# Altium project PCB_Project.PrjPcb
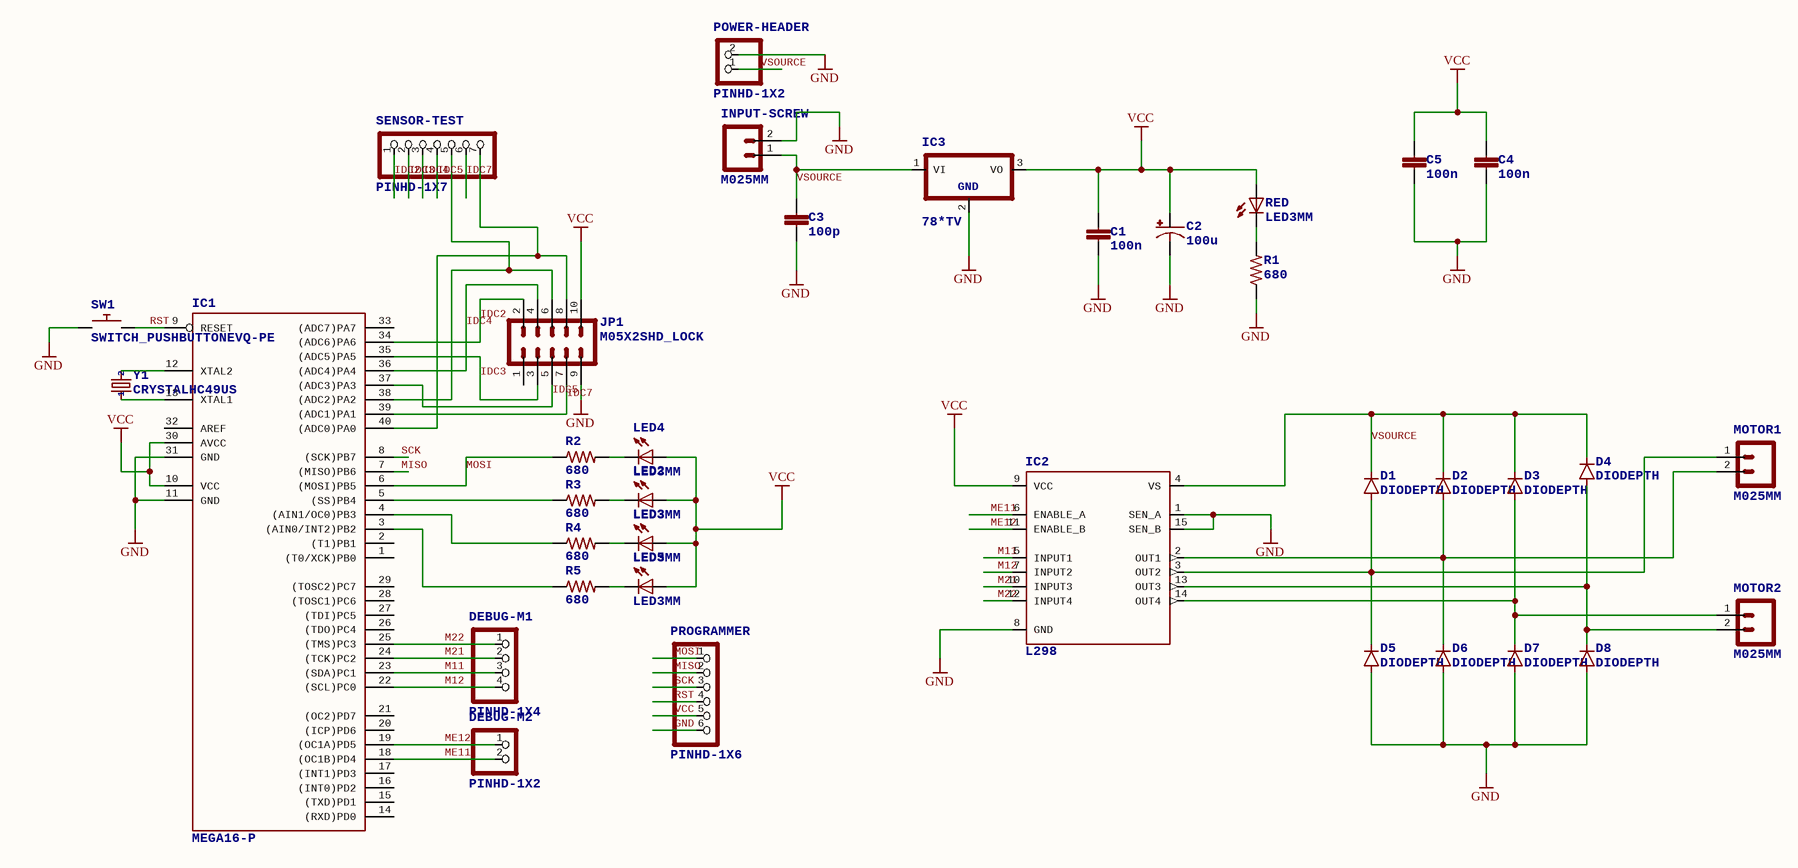
[diagram p0: Sheet1.SchDoc]
1 sheet, 37 parts. Net scope: global (net labels, ports and power ports of the same name join across sheets).
Board file: PCB2.PcbDoc

## Sheet Sheet1.SchDoc
size B

### Parts
C1  100n  [CAP-PTH-SMALL]
C2  100u  [CPOL-RADIAL-100UF-25V]
C3  100p  [CAP-PTH-SMALL]
C4  100n  [CAP-PTH-SMALL]
C5  100n  [CAP-PTH-SMALL]
D1  DIODEPTH  [DIODE-1N4001]
D2  DIODEPTH  [DIODE-1N4001]
D3  DIODEPTH  [DIODE-1N4001]
D4  DIODEPTH  [DIODE-1N4001]
D5  DIODEPTH  [DIODE-1N4001]
D6  DIODEPTH  [DIODE-1N4001]
D7  DIODEPTH  [DIODE-1N4001]
D8  DIODEPTH  [DIODE-1N4001]
DEBUG-M1  PINHD-1X4  [1X04]
DEBUG-M2  PINHD-1X2  [1X02]
IC1  MEGA16-P  [DIL40]
IC2  L298  [MULTIWATT-15]
IC3  78*TV  [TO220V]
INPUT-SCREW  M025MM  [SCREWTERMINAL-5MM-2]
JP1  M05X2SHD_LOCK  [2X5-SHROUDED_LOCK]
LED2  LED3MM  [LED3MM]
LED3  LED3MM  [LED3MM]
LED4  LED3MM  [LED3MM]
LED5  LED3MM  [LED3MM]
MOTOR1  M025MM  [SCREWTERMINAL-5MM-2]
MOTOR2  M025MM  [SCREWTERMINAL-5MM-2]
POWER-HEADER  PINHD-1X2  [1X02]
PROGRAMMER  PINHD-1X6  [1X06]
R1  680  [AXIAL-0.3]
R2  680  [AXIAL-0.3]
R3  680  [AXIAL-0.3]
R4  680  [AXIAL-0.3]
R5  680  [AXIAL-0.3]
RED  LED3MM  [LED3MM]
SENSOR-TEST  PINHD-1X7  [1x07]
SW1  SWITCH_PUSHBUTTONEVQ-PE  [TACT_PANA-EVQ]
Y1  CRYSTALHC49US  [HC49US]

### Nets
GND: C1.2 C2.2(-) C3.1 C4.2 C5.2 D5.A D6.A D7.A D8.A IC1.11(GND) IC1.31(GND) IC2.1(SEN_A) IC2.8(GND) IC2.15(SEN_B) IC3.2(GND) INPUT-SCREW.2 JP1.9 POWER-HEADER.2 PROGRAMMER.6 R1.P$1 SW1.P$1
VCC: C1.1 C2.1(+) C4.1 C5.1 IC1.10(VCC) IC1.30(AVCC) IC2.9(VCC) IC3.3(VO) JP1.10 LED2.A LED3.A LED4.A LED5.A PROGRAMMER.5 RED.A
IDC2: IC1.34((ADC6)PA6) JP1.2 SENSOR-TEST.1
IDC3: IC1.35((ADC5)PA5) JP1.3 SENSOR-TEST.2
IDC4: IC1.36((ADC4)PA4) JP1.4 SENSOR-TEST.3
IDC5: IC1.37((ADC3)PA3) JP1.5 SENSOR-TEST.4
IDC7: IC1.39((ADC1)PA1) JP1.7 SENSOR-TEST.6
M11: DEBUG-M1.3 IC1.23((SDA)PC1) IC2.5(INPUT1)
M12: DEBUG-M1.4 IC1.22((SCL)PC0) IC2.7(INPUT2)
M21: DEBUG-M1.2 IC1.24((TCK)PC2) IC2.10(INPUT3)
M22: DEBUG-M1.1 IC1.25((TMS)PC3) IC2.12(INPUT4)
ME11: DEBUG-M2.2 IC1.18((OC1B)PD4) IC2.6(ENABLE_A)
ME12: DEBUG-M2.1 IC1.19((OC1A)PD5) IC2.11(ENABLE_B)
MISO: IC1.7((MISO)PB6) PROGRAMMER.2
MOSI: IC1.6((MOSI)PB5) PROGRAMMER.1 R2.P$1
RST: IC1.9(RESET) PROGRAMMER.4 SW1.P$2
SCK: IC1.8((SCK)PB7) PROGRAMMER.3
VSOURCE: C3.2 D1.C D2.C D3.C D4.C IC2.4(VS) IC3.1(VI) INPUT-SCREW.1 POWER-HEADER.1
NetD1_A: D1.A D5.C IC2.3(OUT2) MOTOR1.1
NetD2_A: D2.A D6.C IC2.2(OUT1) MOTOR1.2
NetD3_A: D3.A D7.C IC2.14(OUT4) MOTOR2.1
NetD4_A: D4.A D8.C IC2.13(OUT3) MOTOR2.2
NetIC1_3: IC1.3((AIN0/INT2)PB2) R5.P$1
NetIC1_4: IC1.4((AIN1/OC0)PB3) R4.P$1
NetIC1_5: IC1.5((SS)PB4) R3.P$1
NetIC1_12: IC1.12(XTAL2) Y1.2
NetIC1_13: IC1.13(XTAL1) Y1.1
NetIC1_38: IC1.38((ADC2)PA2) JP1.6 SENSOR-TEST.5
NetIC1_40: IC1.40((ADC0)PA0) JP1.8 SENSOR-TEST.7
NetLED2_K: LED2.K(C) R3.P$2
NetLED3_K: LED3.K(C) R4.P$2
NetLED4_K: LED4.K(C) R2.P$2
NetLED5_K: LED5.K(C) R5.P$2
NetR1_P$2: R1.P$2 RED.K(C)

Not connected (* = marked no-connect by the designer): IC1 1((T0/XCK)PB0) 2((T1)PB1) 14((RXD)PD0) 15((TXD)PD1) 16((INT0)PD2) 17((INT1)PD3) 20((ICP)PD6) 21((OC2)PD7) 26((TDO)PC4) 27((TDI)PC5) 28((TOSC1)PC6) 29((TOSC2)PC7) 32(AREF) 33((ADC7)PA7); JP1 1

### Library data of the parts
C1 C3-C5 = CAPPTH: CapacitorStandard 0603 ceramic capacitor, and 0.1" leaded capacitor.
C2 = CAP_POLPTH1: Capacitor PolarizedThese are standard SMD and PTH capacitors. Normally 10uF, 47uF, and 100uF in electrolytic and tantalum varieties. Always verify the external diameter of the through hole cap, it varies with capacity, voltage, and manufacturer. The EIA devices should be standard.
D1-D8 = DIODEPTH: DiodeThese are standard reverse protection diodes and small signal diodes. SMA package can handle up to about 1A. SOD-323 can handle about 200mA. What the SOD-323 package when ordering, there are some mfgs out there that are 5-pin packages.
DEBUG-M1 = PINHD-1X4: PIN HEADER
DEBUG-M2 POWER-HEADER = PINHD-1X2: PIN HEADER
IC1 = MEGA16-P: MICROCONTROLLER   16 Kbytes FLASH 1 kbytes SRAM 512 bytes EEPROM USART 8-channel 10 bit ADC   Source: avr.lbr; MPN: ATMEGA16-16PU; OC_FARNELL: 9171142; OC_NEWARK: 01M6885
IC2 = L298: DUAL FULL-BRIDGE DRIVER; MPN: L298N; OC_FARNELL: 1589425; OC_NEWARK: 32M1527
IC3 = 78*TV: Positive VOLTAGE REGULATOR   Source: http://cache.national.com/ds/LM/LM78L05.pdf http://www.fairchildsemi.com/ds/LM/LM7805.pdf; GND: GND
INPUT-SCREW MOTOR1 MOTOR2 = M025MM: Standard 2-pin 0.1" header. Use with  - straight break away headers ( PRT-00116) - right angle break away headers (PRT-00553) - swiss pins (PRT-00743) - machine pins (PRT-00117) - female headers (PRT-00115)   Molex polarized connector foot print use with: PRT-08233 with associated crimp pins and housings.  2.54_SCREWTERM for use with  PRT-10571.  3.5mm Screw Terminal footprints for  PRT-08084  5mm Screw Terminal footprints for use with PRT-08432; STOREFRONT_ID: PRT-08432
JP1 = M05X2SHD_LOCK: Header 5x2Standard 10-pin dual row 0.1" header. Commonly used with AVR-ISP. Use with Spark Fun Electronics SKU: PRT-00778
LED2-LED5 RED = LED3MM: LED   OSRAM: - CHIPLED LG R971, LG N971, LY N971, LG Q971, LY Q971, LO R971, LY R971 LH N974, LH R974 LS Q976, LO Q976, LY Q976 LO Q996 - Hyper CHIPLED LW Q18S LB Q993, LB Q99A, LB R99A - SideLED LS A670, LO A670, LY A670, LG A670, LP A670 LB A673, LV A673, LT A673, LW A673 LH A674 LY A675 LS A676, LA A676, LO A676, LY A676, LW A676 LS A679, LY A679, LG A679 -  Hyper Micro SIDELED® LS Y876, LA Y876, LO Y876, LY Y876 LT Y87S - SmartLED LW L88C, LW L88S LB L89C, LB L89S, LG L890 LS L89K, LO L89K, LY L89K LS L896, LA L896, LO L896, LY L896 - TOPLED LS T670, LO T670, LY T670, LG T670, LP T670 LSG T670, LSP T670, LSY T670, LOP T670, LYG T670 LG T671, LOG T671, LSG T671 LB T673, LV T673, LT T673, LW T673 LH T674 LS T676, LA T676, LO T676, LY T676, LB T676, LH T676, LSB T676, LW T676 LB T67C, LV T67C, LT T67C, LS T67K, LO T67K, LY T67K, LW E67C LS E67B, LA E67B, LO E67B, LY E67B, LB E67C, LV E67C, LT E67C LW T67C LS T679, LY T679, LG T679 LS T770, LO T770, LY T770, LG T770, LP T770 LB T773, LV T773, LT T773, LW T773 LH T774 LS E675, LA E675, LY E675, LS T675 LS T776, LA T776, LO T776, LY T776, LB T776 LHGB T686 LT T68C, LB T68C - Hyper Mini TOPLED® LB M676 - Mini TOPLED Santana® LG M470 LS M47K, LO M47K, LY M47K    Source: http://www.osram.convergy.de/
PROGRAMMER = PINHD-1X6: PIN HEADER
R1-R5 = 1KOHM-1/4W-1%(PTH): RES-12182; VALUE: 1K; PROD_ID: RES-12182
SENSOR-TEST = PINHD-1X7: PIN HEADER
SW1 = SWITCH_PUSHBUTTONEVQ-PE: ButtonsSOFTTOUCHSMD_SJ - Soft touch temporary push button (Super Junk Akihabara)    Compatible with SKPMANE010 [Mouser: 688-SKPMAN]   C&K_KSS = Digikey: KSS221GLFS
Y1 = CRYSTALHC49US: Various standard crystals. Proven footprints.; 1: 1; 2: 2